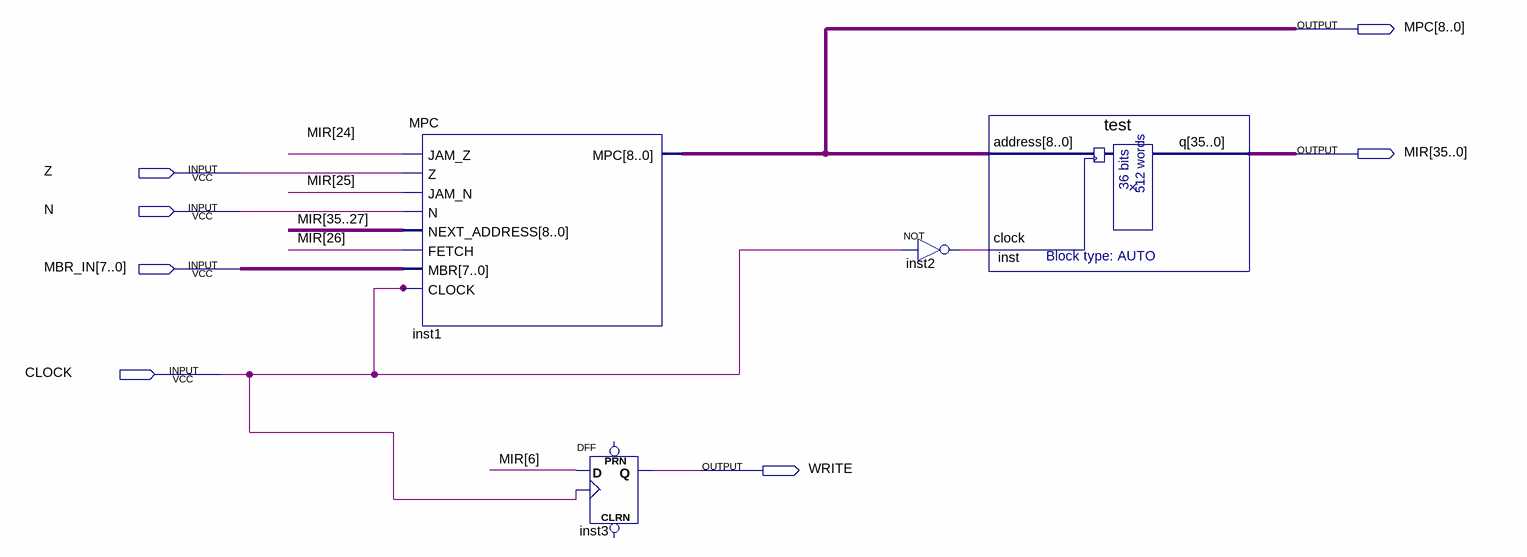
[diagram p0: schematic sheet]
// Quartus schematic CONTROL_UNIT.bdf as structural Verilog: 4 symbols, 7 pins
module CONTROL_UNIT (
  input  Z,
  input  N,
  input  [7:0] MBR_IN,
  input  CLOCK,
  output [8:0] MPC,
  output [35:0] MIR,
  output WRITE
);

  wire inst2_out;

  MPC inst1 (
    .JAM_Z(MIR[24]), .Z(Z), .JAM_N(MIR[25]), .N(N), .NEXT_ADDRESS(MIR[35:27]), .FETCH(MIR[26]), .MBR(MBR_IN),
    .CLOCK(CLOCK), .MPC(MPC));
  DFF inst3 (.CLK(CLOCK), .D(MIR[6]), .Q(WRITE));  // open: CLRN, PRN
  not inst2 (inst2_out, CLOCK);
  test inst (.address(MPC), .clock(inst2_out), .q(MIR));
endmodule
